# Altium schematic sheet CONTROL-PANEL.SchDoc: DIGITAL CLOCK MCU
size A4; Author: Én; Organization: PIF Club; Address1: Room 304, B1 Block; Address2: HCMUT; Address3: 268 Ly Thuong Kiet St.; Address4: Ward 14, District 10, HCMC; Revision: v1.0; SheetNumber: 2; SheetTotal: 2; ProjectTitle: DIGITAL CLOCK MCU
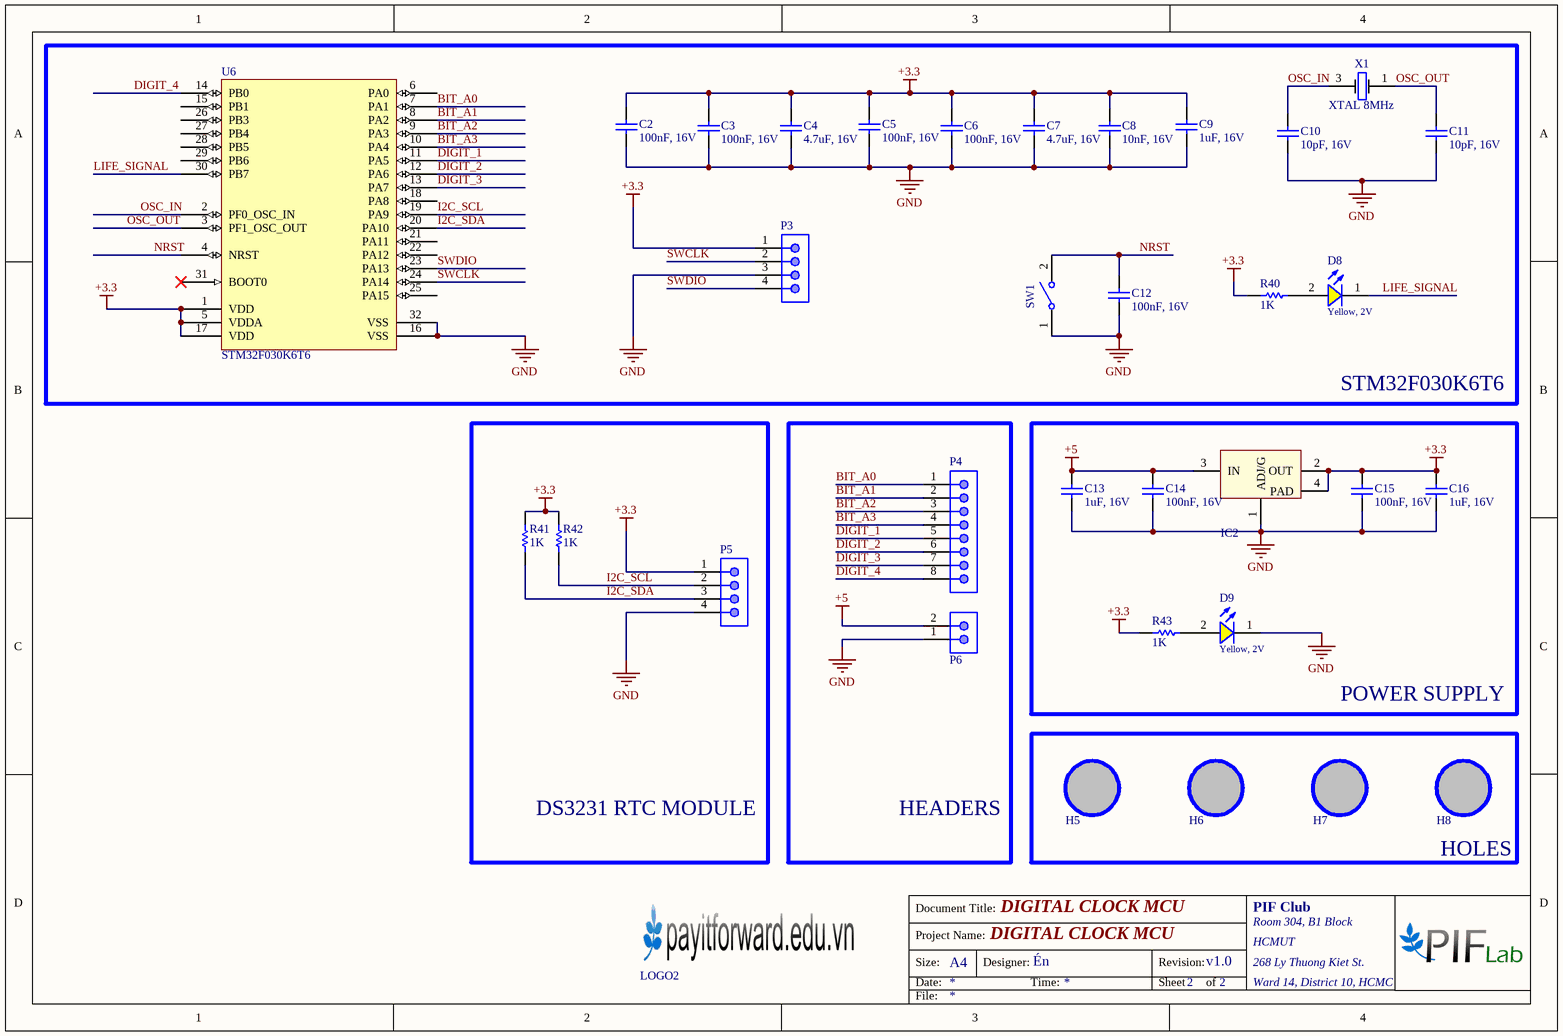
[diagram p0: CONTROL-PANEL.SchDoc]

## Parts
C2  value 100nF, 16V  [CAP-SM-0603]  (hidden comment: Cap Non-Pol SMD)
C3  value 100nF, 16V  [CAP-SM-0603]  (hidden comment: Cap Non-Pol SMD)
C4  value 4.7uF, 16V  [CAP-SM-0603]  (hidden comment: Cap Non-Pol SMD)
C5  value 100nF, 16V  [CAP-SM-0603]  (hidden comment: Cap Non-Pol SMD)
C6  value 100nF, 16V  [CAP-SM-0603]  (hidden comment: Cap Non-Pol SMD)
C7  value 4.7uF, 16V  [CAP-SM-0603]  (hidden comment: Cap Non-Pol SMD)
C8  value 10nF, 16V  [CAP-SM-0603]  (hidden comment: Cap Non-Pol SMD)
C9  value 1uF, 16V  [CAP-SM-0603]  (hidden comment: Cap Non-Pol SMD)
C10  value 10pF, 16V  [CAP-SM-0603]  (hidden comment: Cap Non-Pol SMD)
C11  value 10pF, 16V  [CAP-SM-0603]  (hidden comment: Cap Non-Pol SMD)
C12  value 100nF, 16V  [CAP-SM-0603]  (hidden comment: Cap Non-Pol SMD)
C13  value 1uF, 16V  [CAP-SM-0603]  (hidden comment: Cap Non-Pol SMD)
C14  value 100nF, 16V  [CAP-SM-0603]  (hidden comment: Cap Non-Pol SMD)
C15  value 100nF, 16V  [CAP-SM-0603]  (hidden comment: Cap Non-Pol SMD)
C16  value 1uF, 16V  [CAP-SM-0603]  (hidden comment: Cap Non-Pol SMD)
D8  Yellow, 2V  [WL-SMCW_0603_H=0.7mm]
D9  Yellow, 2V  [WL-SMCW_0603_H=0.7mm]
H5  Hole  [LO KHOAN 3MM]  (value not drawn)
H6  Hole  [LO KHOAN 3MM]  (value not drawn)
H7  Hole  [LO KHOAN 3MM]  (value not drawn)
H8  Hole  [LO KHOAN 3MM]  (value not drawn)
IC2  LM1117  [SOT223-4N]  (value not drawn)
LOGO2  LOGO PIF  [PIF LOGO SMALL SSTOP]  (value not drawn)
P3  61900411121  [61900411121]  (value not drawn)
P4  62000811622  [62000811622]  (value not drawn)
P5  62000411622  [62000411622]  (value not drawn)
P6  62000211622  [62000211622]  (value not drawn)
R40  value 1K  [RES-SM-0603]  (hidden comment: RESISTOR SMD)
R41  value 1K  [RES-SM-0603]  (hidden comment: RESISTOR SMD)
R42  value 1K  [RES-SM-0603]  (hidden comment: RESISTOR SMD)
R43  value 1K  [RES-SM-0603]  (hidden comment: RESISTOR SMD)
SW1  434111025826  [WS-TASV_L6W3.8H2.5_4341x10258x6]  (value not drawn)
U6  STM32F030K6T6  [STM32F030K6T6]
X1  XTAL 8MHz  [XTAL 3225]

## Blocks framed on the sheet
STM32F030K6T6: C2-C12 D8 P3 R40 SW1 U6 X1
DS3231 RTC MODULE: P5 R41 R42
HEADERS: P4 P6
POWER SUPPLY: C13-C16 D9 IC2 R43
HOLES: H5-H8

## Nets
+3.3: C2.2 C3.2 C4.2 C5.2 C6.2 C7.2 C8.2 C9.2 C15.2 C16.2 IC2.2(OUT) IC2.4(PAD) P3.1 P5.1 R40.2 R41.1 R42.1 R43.2 U6.1(VDD) U6.5(VDDA) U6.17(VDD)
+5: C13.2 C14.2 IC2.3(IN) P6.2
GND: C2.1 C3.1 C4.1 C5.1 C6.1 C7.1 C8.1 C9.1 C10.1 C11.1 C12.1 C13.1 C14.1 C15.1 C16.1 D9.1(K) IC2.1(ADJ/G) P3.3 P5.4 P6.1 SW1.1 U6.16(VSS) U6.32(VSS)
BIT_A0: P4.1 U6.7(PA1)
BIT_A1: P4.2 U6.8(PA2)
BIT_A2: P4.3 U6.9(PA3)
BIT_A3: P4.4 U6.10(PA4)
DIGIT_1: P4.5 U6.11(PA5)
DIGIT_2: P4.6 U6.12(PA6)
DIGIT_3: P4.7 U6.13(PA7)
DIGIT_4: P4.8 U6.14(PB0)
I2C_SCL: P5.2 R42.2 U6.19(PA9)
I2C_SDA: P5.3 R41.2 U6.20(PA10)
LIFE_SIGNAL: D8.1(K) U6.30(PB7)
NRST: C12.2 SW1.2 U6.4(NRST)
OSC_IN: C10.2 U6.2(PF0_OSC_IN) X1.3
OSC_OUT: C11.2 U6.3(PF1_OSC_OUT) X1.1
SWCLK: P3.2 U6.24(PA14)
SWDIO: P3.4 U6.23(PA13)
NetD8_2: D8.2(A) R40.1
NetD9_2: D9.2(A) R43.1

Not connected (* = marked no-connect by the designer): H5 1; H6 1; H7 1; H8 1; U6 6(PA0) 15(PB1) 18(PA8) 21(PA11) 22(PA12) 25(PA15) 26(PB3) 27(PB4) 28(PB5) 29(PB6) 31(BOOT0)*

## Notes on the sheet
- Document Title:
- Size:
- Date:
- Project Name:
- A4
- Designer:
- Time:
- Revision:
- Sheet
- of
- File:

## Library data of the parts
C2-C16 = Cap Non-Pol SMD: Capacitor
D8 D9 = 150060YS75000: WL-SMCW SMT Mono-color Chip LED Waterclear, size 0603, Yellow, 2V, 140deg; Chip Technology: AlInGaP; Dominant Wavelength typ.: 590nm; Luminous Intensity typ.: 120mcd; Peak Wavelength typ.: 595nm; Viewing Angle: 140deg; ComponentLink1Description: Manufacturer; ComponentLink1URL: http://www.we-online.de; ComponentLink2URL: https://www.we-online.com/catalog/datasheet/150060YS75000.pdf; ComponentLink2Description: Datasheet; Forward Voltage typ.: 2V; Emitting Color: Yellow; Mounting Technology: SMT; Operating Temperature: -40 to +85degC; Published Date: December 2019; Part Number: 150060YS75000; Packaging: Tape and Reel; Size: 0603; Publisher: Wurth Elektronik
H5-H8 = Hole: Hole 3mm
IC2 = LM1117: Available in 1.8V, 2.5V, 2.85V, 3.3V, 5V, and  Adjustable Versions; Value: LM1117
P3 = 61900411121: WR-WTB THT Male Vertical Locking Header, pitch 2.54mm, 4p; Pin Number: 4; Contact Resistance: 20mOhm; Rated Current: 3A; Withstanding Voltage: 1000VAC; Working Voltage: 250VAC; ComponentLink1Description: Manufacturer; ComponentLink1URL: http://www.we-online.de; ComponentLink2Description: Datasheet; ComponentLink2URL: https://www.we-online.com/catalog/datasheet/61900411121.pdf; Pitch: 2.54mm; Published Date: January 2020; Publisher: Wurth Elektronik; Mounting Technology: THT; Packaging: Bag; Operating Temperature: -40 to +105degC; Part Number: 61900411121; Gender: Male; Type: Vertical
P4 = 62000811622: WR-WTB Male Vertical Shrouded Header, pitch 2mm, 8p; Pin Number: 8; Contact Resistance: 20mOhm; Rated Current: 2A; Withstanding Voltage: 800VAC; Working Voltage: 125VAC; ComponentLink1Description: Manufacturer; ComponentLink1URL: http://www.we-online.de; ComponentLink2Description: Datasheet; ComponentLink2URL: https://www.we-online.com/catalog/datasheet/62000811622.pdf; Pitch: 2mm; Published Date: January 2020; Publisher: Wurth Elektronik; Mounting Technology: THT; Packaging: Bag; Operating Temperature: -25 to +85degC; Part Number: 62000811622; Gender: Male; Type: Vertical
P5 = 62000411622: WR-WTB Male Vertical Shrouded Header, pitch 2mm, 4p; Pin Number: 4; Contact Resistance: 20mOhm; Rated Current: 2A; Withstanding Voltage: 800VAC; Working Voltage: 125VAC; ComponentLink1Description: Manufacturer; ComponentLink1URL: http://www.we-online.de; ComponentLink2Description: Datasheet; ComponentLink2URL: https://www.we-online.com/catalog/datasheet/62000411622.pdf; Pitch: 2mm; Published Date: January 2020; Publisher: Wurth Elektronik; Mounting Technology: THT; Packaging: Bag; Operating Temperature: -25 to +85degC; Part Number: 62000411622; Gender: Male; Type: Vertical
P6 = 62000211622: WR-WTB Male Vertical Shrouded Header, pitch 2mm, 2p; Pin Number: 2; Contact Resistance: 20mOhm; Rated Current: 2A; Withstanding Voltage: 800VAC; Working Voltage: 125VAC; ComponentLink1Description: Manufacturer; ComponentLink1URL: http://www.we-online.de; ComponentLink2Description: Datasheet; ComponentLink2URL: https://www.we-online.com/catalog/datasheet/62000211622.pdf; Pitch: 2mm; Published Date: January 2020; Publisher: Wurth Elektronik; Mounting Technology: THT; Packaging: Bag; Operating Temperature: -25 to +85degC; Part Number: 62000211622; Gender: Male; Type: Vertical
R40-R43 = RESISTOR SMD: Resistor
SW1 = 434111025826: WS-TASV SMT Tact Switch, 12VDC, 50mA, 260g, height 2.5mm; Manufacturer: Wurth Elektronik; Rated Voltage: 12V; Washable: No; Actuator Color: White; Electrical Life: 30000Cycles; ComponentLink1Description: Manufacturer Link; ComponentLink1URL: http://www.we-online.de; ComponentLink2Description: Datasheet; ComponentLink2URL: https://www.we-online.com/catalog/datasheet/434111025826.pdf; Manufacturer Part Number: 434111025826; Contact Material: Stainless Steel; Mounting Technology: SMT; Contact Plating: Silver; Operation Force: 260g; Packaging: Tape and Reel; Terminal Material: Copper Alloy; Rated Current: 50mA; Terminal Plating: Silver; Height: 2.5mm; Length: 6mm; Operating Temperature max.: 85C; Operating Temperature min.: -40C; Width: 3.8mm
U6 = STM32F030K6T6: ARM Cortex M0 Microcontroller IC 32-Bit 48MHz 32KB FLASH, 32-LQFP; Mfr: STMicroelectronics; Number of I/O: 26; Program Memory Size: 32KB (32K x 8); Connectivity: I²C, SPI, UART/USART; Peripherals: DMA, POR, PWM, WDT; Speed: 48MHz; Package / Case: 32-LQFP; Program Memory Type1: FLASH
X1 = XTAL: Value: 8MHz